# EAGLE board ubalancev0 (EAGLE 7.1.0)
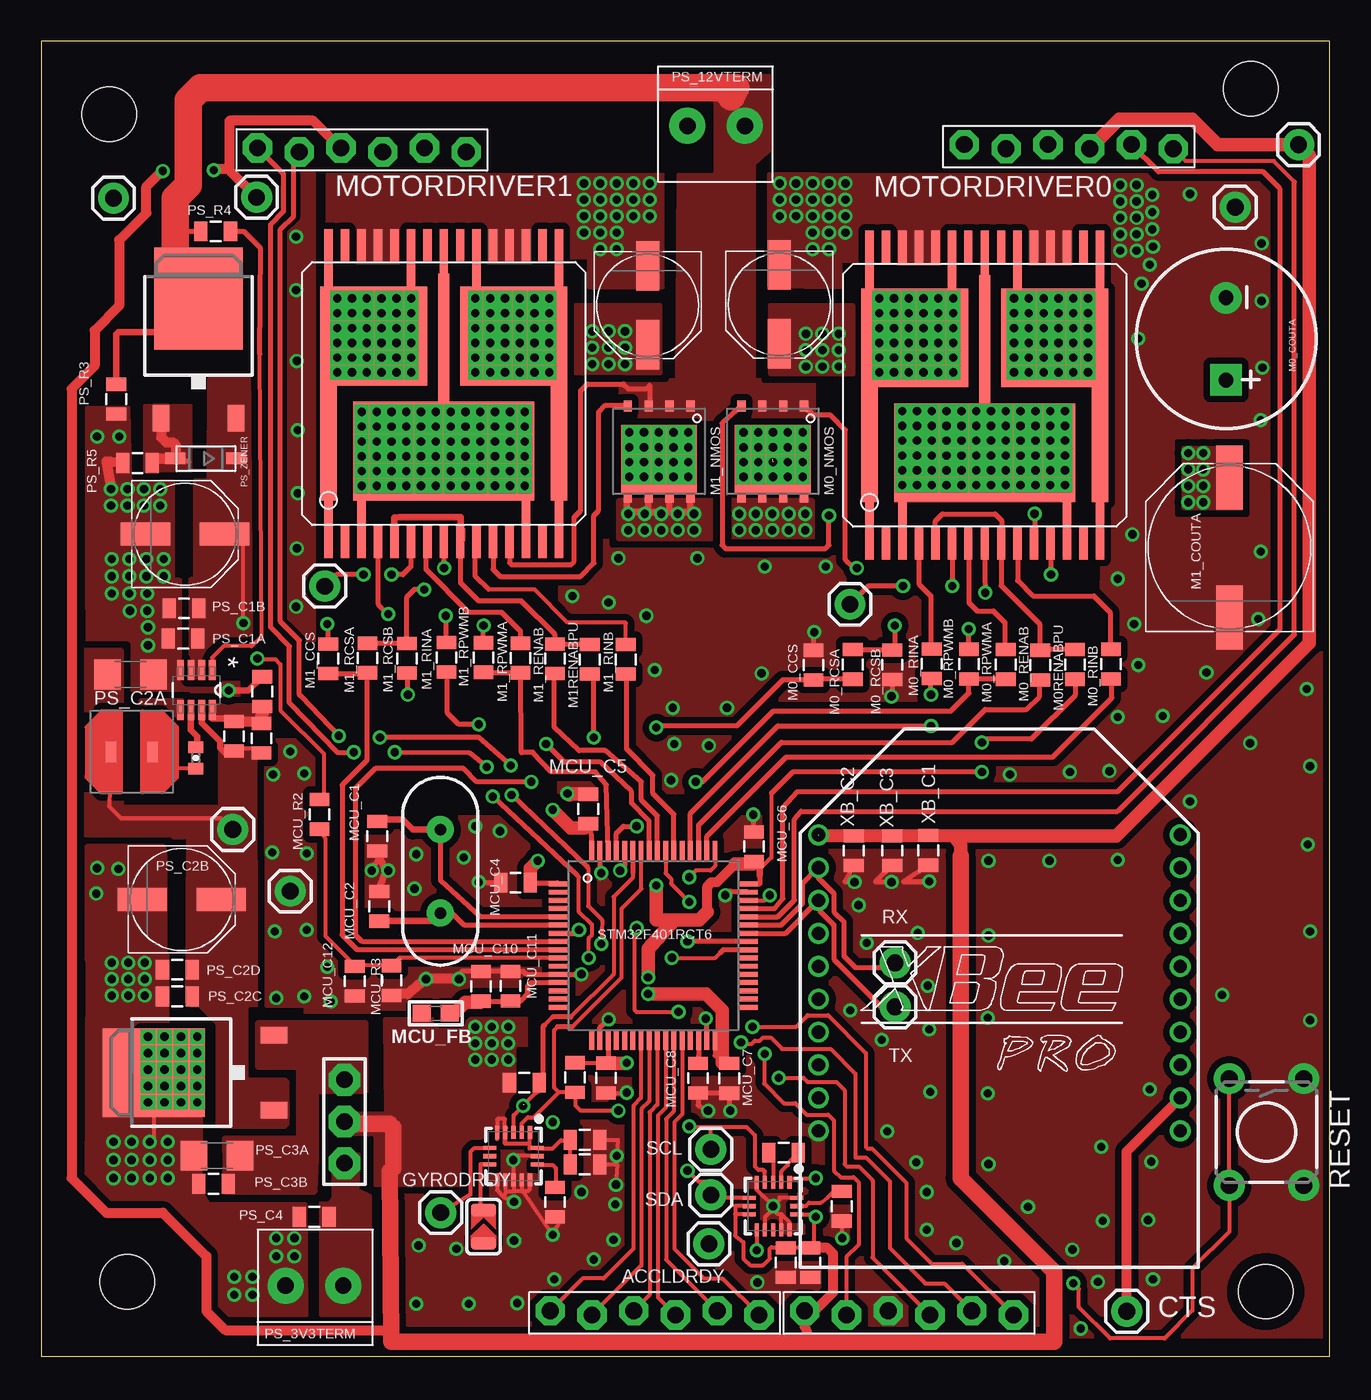
[diagram p2: board, top side]
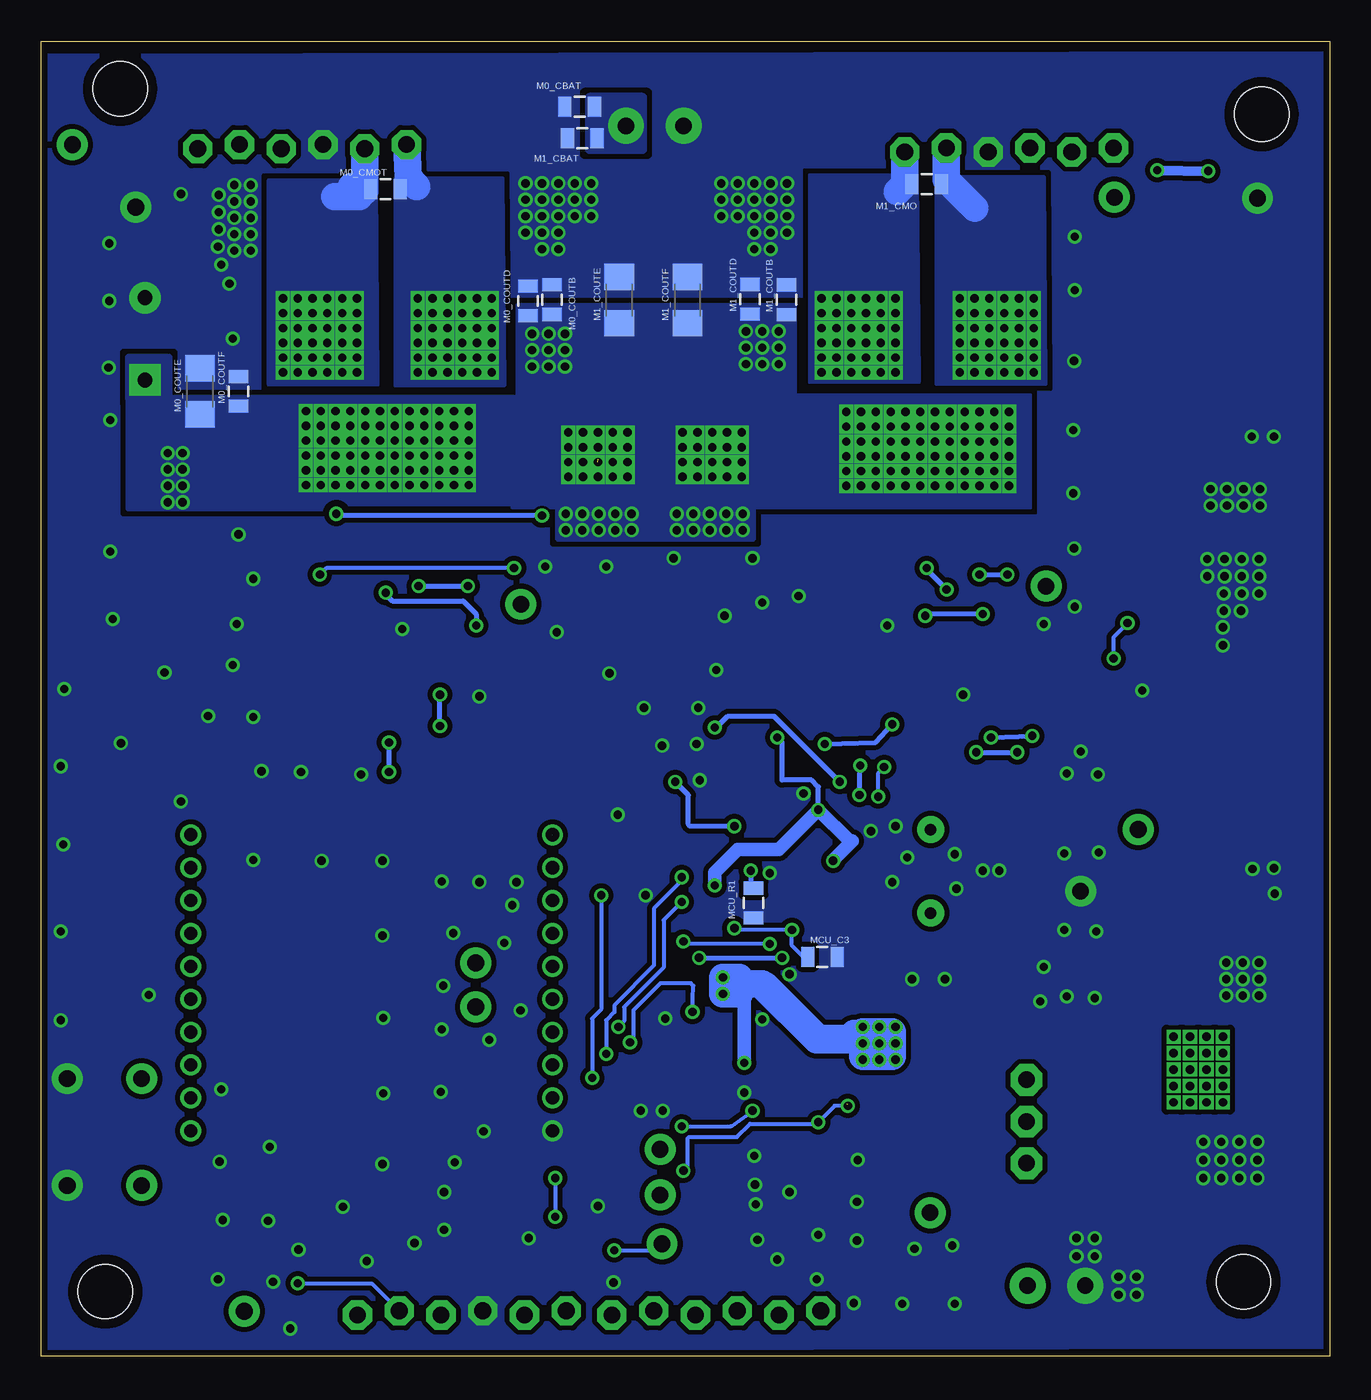
[diagram p3: board, bottom side, seen from below]

Size 78.35 x 80 mm. Coordinates in mm from the lower left corner, seen from the top.
Outline: 0,0 78.35,0 78.35,80 0,80 0,0
Copper layers (1*16): Top 0.0356mm / dielectric 1.5011mm / Bottom 0.0356mm
Design rules "LaenPCBOrder": minimum track width 6mil, minimum drill 13mil, track to track 6mil, track to pad 6mil, pad to pad 6mil, via to via 6mil, smd to smd 6mil, copper to edge 15mil, drill to drill 6mil, minimum pad ring 7mil, minimum via ring 7mil, stop-mask expansion 3mil, vias tented up to drill 0mil, thermal gap 10mil

## Footprints (pad centres in the part's own frame; a part is rotated, then mirrored left to right if it is on the bottom)
JUMPER3 = drill 1 pad 1.93 octagon: 1 -2.54,0; 2 0,0; 3 2.54,0
1X01 = drill 1.016 pad 1.88: 1 0,0
1X06-BIGLOCK = drill 1.016 pad 1.778 octagon: 1 -6.35,0.127; 2 -3.81,-0.127; 3 -1.27,0.127; 4 1.27,-0.127; 5 3.81,0.127; 6 6.35,-0.127
SOT65P280X100-8N = smd 1.219 x 0.406: 1 -1.219,0.965; 2 -1.219,0.33; 3 -1.219,-0.33; 4 -1.219,-0.965; 5 1.219,-0.965; 6 1.219,-0.33; 7 1.219,0.33; 8 1.219,0.965
0805 = smd 0.8 x 1.2: 1 -0.9,0; 2 0.9,0
CPOL-RADIAL-1000UF-25V-KIT = drill 0.9 pad 1.93 square: + 2.5,0 | drill 0.9 pad 1.93: - -2.5,0
PANASONIC_D = smd 3 x 1.4: + 2.4,0; - -2.4,0
1206 = smd 1.6 x 1.8: 1 -1.4,0; 2 1.4,0
8DFN-5*6MM = smd 0.5 x 0.65: D1 -1.905,2.8; D2 -0.635,2.8; D3 0.635,2.8; D4 1.905,2.8; G 1.905,-2.755; S1 -1.905,-2.755; S2 -0.635,-2.755; S3 0.635,-2.755 | smd 4.6 x 4.12: D5 0,0.46
PANASONIC_G = smd 3.9 x 1.6: + 4.25,0; - -4.25,0
0603 = smd 1.1 x 1: 1 -0.85,0; 2 0.85,0
MULTIPOWERSO-30 = smd 0.508 x 12: 1 -7,-4; 15 7,-4; 16 7,4; 30 -7,4 | smd 0.508 x 2: 2 -6,-9; 4 -4,-9; 5 -3,-9; 6 -2,-9; 7 -1,-9; 8 0,-9; 9 1,-9; 10 2,-9; 11 3,-9; 12 4,-9; 14 6,-9; 17 6,9; 18 5,9; 19 4,9; 20 3,9; 22 1,9; 24 -1,9; 26 -3,9; 27 -4,9; 28 -5,9; 29 -6,9 | smd 0.508 x 4: 3 -5,-8; 13 5,-8; 21 2,8; 23 0,8; 25 -2,8 | smd 6.5 x 6: OUTA -4.25,3.5; OUTB 4.25,3.5 | smd 1 x 7.5: OUTA@1 -7,-2.755; OUTB@1 7,-2.755 | smd 11 x 6: VCC 0,-3.5 | smd 0.65 x 8.3: VCC@1 0,3.145
1X2-3.5MM = drill 1 pad 2.184: 1 1.8,0; 2 -1.7,0
0402-CAP = smd 0.7 x 0.9: 1 -0.65,0; 2 0.65,0
VLCF5024 = smd 1.27 x 0.635: P1 0,1.27; P2 0,-1.27
TO252 = smd 1 x 1.6: 1 -2.28,-4.8; 2 2.28,-4.8 | smd 5.4 x 6.2: 3 0,2.5
SOD-123 = smd 1.2 x 0.7: A 1.85,0; C -1.85,0
TACTILE-PTH = drill 1.016 pad 1.88: 1 -3.251,2.261; 2 3.251,2.261; 3 -3.251,-2.261; 4 3.251,-2.261
SOLDERJUMPER_ARROW_NOPASTE = smd 0.762 x 1.524: 1 -1.016,0; 2 1.016,0
STAND-OFF = hole 3.302: 0,0
LQFP64 = smd 1.2 x 0.3: 1 -5.75,3.75; 2 -5.75,3.25; 3 -5.75,2.75; 4 -5.75,2.25; 5 -5.75,1.75; 6 -5.75,1.25; 7 -5.75,0.75; 8 -5.75,0.25; 9 -5.75,-0.25; 10 -5.75,-0.75; 11 -5.75,-1.25; 12 -5.75,-1.75; 13 -5.75,-2.25; 14 -5.75,-2.75; 15 -5.75,-3.25; 16 -5.75,-3.75; 33 5.75,-3.75; 34 5.75,-3.25; 35 5.75,-2.75; 36 5.75,-2.25; 37 5.75,-1.75; 38 5.75,-1.25; 39 5.75,-0.75; 40 5.75,-0.25; 41 5.75,0.25; 42 5.75,0.75; 43 5.75,1.25; 44 5.75,1.75; 45 5.75,2.25; 46 5.75,2.75; 47 5.75,3.25; 48 5.75,3.75 | smd 0.3 x 1.2: 17 -3.75,-5.75; 18 -3.25,-5.75; 19 -2.75,-5.75; 20 -2.25,-5.75; 21 -1.75,-5.75; 22 -1.25,-5.75; 23 -0.75,-5.75; 24 -0.25,-5.75; 25 0.25,-5.75; 26 0.75,-5.75; 27 1.25,-5.75; 28 1.75,-5.75; 29 2.25,-5.75; 30 2.75,-5.75; 31 3.25,-5.75; 32 3.75,-5.75; 49 3.75,5.75; 50 3.25,5.75; 51 2.75,5.75; 52 2.25,5.75; 53 1.75,5.75; 54 1.25,5.75; 55 0.75,5.75; 56 0.25,5.75; 57 -0.25,5.75; 58 -0.75,5.75; 59 -1.25,5.75; 60 -1.75,5.75; 61 -2.25,5.75; 62 -2.75,5.75; 63 -3.25,5.75; 64 -3.75,5.75
LGA16_3X3MM = smd 0.8 x 0.25: 1 -1.45,1; 2 -1.45,0.5; 3 -1.45,0; 4 -1.45,-0.5; 5 -1.45,-1; 9 1.45,-1; 10 1.45,-0.5; 11 1.45,0; 12 1.45,0.5; 13 1.45,1 | smd 0.25 x 0.8: 6 -0.5,-1.45; 7 0,-1.45; 8 0.5,-1.45; 14 0.5,1.45; 15 0,1.45; 16 -0.5,1.45
XBEE-PRO = drill 0.8 pad 1.27: 1 -11,9; 2 -11,7; 3 -11,5; 4 -11,3; 5 -11,1; 6 -11,-1; 7 -11,-3; 8 -11,-5; 9 -11,-7; 10 -11,-9; 11 11,-9; 12 11,-7; 13 11,-5; 14 11,-3; 15 11,-1; 16 11,1; 17 11,3; 18 11,5; 19 11,7; 20 11,9
HC49US = drill 0.7 pad 1.651: 1 -2.54,0; 2 2.54,0

## Placement (x,y rotation side)
3V3JUMPER  [JUMPER3]  18.44,14.29 270 top
3V3OUTM0  M01PTH  [1X01]  76.45,73.7 0 top
3V3OUTM1  M01PTH  [1X01]  13.1,70.5 0 top
5VOUT  M01PTH  [1X01]  11.65,32.05 0 top
ACCLDRDY  M01PTH  [1X01]  40.6,6.85 0 top
BREAKOUT  [1X06-BIGLOCK]  37.3,2.65 180 top
BUCK  LT3470ITS8PBF  [SOT65P280X100-8N]  9.44,40.53 270 top
CTS  M01PTH  [1X01]  66,2.75 0 top
GND_OUT  M01PTH  [1X01]  15.15,28.3 0 top
GND_OUT1  M01PTH  [1X01]  72.6,69.9 0 top
GND_OUT2  M01PTH  [1X01]  4.4,70.45 0 top
GYRODRDY  M01PTH  [1X01]  24.3,8.75 0 top
IMU_C1A  0.1uF  [0805]  33.06,11.68 0 top
IMU_C1B  10uF  [0805]  33.06,13.17 0 top
IMU_C1C  10nF  [0805]  31.24,9.39 270 top
IMU_C2A  0.1uF  [0805]  46.76,5.71 270 top
IMU_C2B  10uF  [0805]  45.27,5.71 270 top
IMU_C2C  0.22uF  [0805]  45.14,12.4 0 top
IMU_C2D  4.7uF  [0805]  48.67,9.14 90 top
M0_BUS  [1X06-BIGLOCK]  62.48,73.58 0 top
M0_CBAT  1uF  [0805]  45.61,76.01 180 bottom
M0_CCS  47nF  [0805]  46.96,42.05 90 top
M0_CMOT  0.1uF  [0805]  57.41,70.99 180 bottom
M0_COUTA  1000uf/25V  [CPOL-RADIAL-1000UF-25V-KIT]  72.04,61.89 270 top
M0_COUTB  0.1uF  [0805]  47.29,64.28 90 bottom
M0_COUTC  100uF  [PANASONIC_D]  44.88,63.98 270 top
M0_COUTD  1uF  [0805]  48.75,64.2 90 bottom
M0_COUTE  22uF  [1206]  68.7,58.7 90 bottom
M0_COUTF  22uF  [0805]  66.35,58.7 90 bottom
M0_CSDISABLE  M01PTH  [1X01]  49.18,45.75 0 top
M0_NMOS  AON6812  [8DFN-5*6MM]  44.48,55.05 180 top
M0_RCSA  10K  [0805]  49.35,42.09 90 top
M0_RCSB  1K  [0805]  51.75,42.07 90 top
M0_RENAB  1K  [0805]  60.75,42.05 90 top
M0_RINA  1K  [0805]  54.15,42.13 90 top
M0_RINB  1K  [0805]  65.05,42.11 90 top
M0_RPWMA  1K  [0805]  58.65,42.09 90 top
M0_RPWMB  10K  [0805]  56.41,42.11 270 top
M0RENABPU  10K  [0805]  62.86,42.09 90 top
M1_BUS  [1X06-BIGLOCK]  19.5,73.38 180 top
M1_CBAT  1uF  [0805]  45.45,74.09 180 bottom
M1_CCS  47nF  [0805]  17.46,42.44 90 top
M1_CMO  0.1uF  [0805]  24.51,71.3 180 bottom
M1_COUTA  470uF  [PANASONIC_G]  72.25,49.2 90 top
M1_COUTB  0.1uF  [0805]  33.04,64.27 90 bottom
M1_COUTC  100uF  [PANASONIC_D]  36.87,63.93 270 top
M1_COUTD  1uF  [0805]  35.25,64.3 90 bottom
M1_COUTE  22uF  [1206]  43.2,64.25 90 bottom
M1_COUTF  22uF  [1206]  39.05,64.25 90 bottom
M1_CSDISABLE  M01PTH  [1X01]  17.25,46.85 0 top
M1_NMOS  N-MOSFET-AON6812  [8DFN-5*6MM]  37.57,55.05 180 top
M1_RCSA  10K  [0805]  19.85,42.48 90 top
M1_RCSB  1K  [0805]  22.25,42.46 90 top
M1_RENAB  1K  [0805]  31.25,42.44 90 top
M1_RINA  1K  [0805]  24.65,42.52 90 top
M1_RINB  1K  [0805]  35.55,42.4 90 top
M1_RPWMA  1K  [0805]  29.15,42.48 90 top
M1_RPWMB  10K  [0805]  26.89,42.51 270 top
M1RENABPU  4.7K  [0805]  33.36,42.4 90 top
MCU_C1  20pF  [0805]  20.44,31.64 270 top
MCU_C2  20pF  [0805]  20.56,27.38 90 top
MCU_C3  0.1uF  [0805]  30.85,24.3 0 bottom
MCU_C4  1uF  [0805]  28.84,28.81 180 top
MCU_C5  0.1uF  [0805]  33.26,33.3 90 top
MCU_C6  0.1uF  [0805]  43.34,31.01 270 top
MCU_C7  0.1uF  [0805]  41.84,16.92 270 top
MCU_C8  4.7uF  [0805]  39.94,16.93 270 top
MCU_C9  0.1uF  [0805]  34.34,16.94 270 top
MCU_C10  0.1uF  [0805]  26.75,22.51 90 top
MCU_C11  12pF  [0805]  28.53,22.53 270 top
MCU_C12  0.1uF  [0805]  19.07,22.83 270 top
MCU_FB  [0603]  23.99,20.87 0 top
MCU_R1  10k  [0805]  35.04,27.58 270 bottom
MCU_R2  100k  [0805]  16.92,32.97 90 top
MCU_R3  13k  [0805]  21.31,22.87 90 top
MCU_RSCL  10k  [0805]  32.46,16.97 90 top
MCU_RSDA  10k  [0805]  29.38,16.65 180 top
MOTORDRIVER0  VNH5019  [MULTIPOWERSO-30]  57.37,58.46 0 top
MOTORDRIVER1  VNH5019  [MULTIPOWERSO-30]  24.48,58.56 0 top
PROGAMMER_BUS  [1X06-BIGLOCK]  52.77,2.65 0 top
PS_3V3TERM  1X2-3.5MM  [1X2-3.5MM]  16.57,4.31 0 top
PS_12VTERM  1X2-3.5MM  [1X2-3.5MM]  41.09,74.85 180 top
PS_C1A  0.1uF  [0805]  8.63,43.66 180 top
PS_C1B  1uF  [0805]  8.69,45.5 180 top
PS_C1C  100uF  [PANASONIC_D]  8.75,50.01 0 top
PS_C2A  22 uF  [1206]  5.43,41.48 0 top
PS_C2B  47uF  [PANASONIC_D]  8.55,27.79 0 top
PS_C2C  0.1uF  [0805]  8.28,21.9 180 top
PS_C2D  1uF  [0805]  8.28,23.52 180 top
PS_C3A  33 uF  [1206]  10.7,12.22 180 top
PS_C3B  0.1uF  [0805]  10.48,10.5 180 top
PS_C4  0.1uF  [0805]  16.6,8.5 180 top
PS_CBIASFB  22 pF  [0805]  13.4,37.6 90 top
PS_CBOOST  .22 uF  [0402-CAP]  9.4,36.41 270 top
PS_IND  33uH  [VLCF5024]  5.51,36.78 270 top
PS_LDO  7824DT  [TO252]  9.36,17.26 90 top
PS_PMOS  FDD4141TO252  [TO252]  9.57,61.85 0 top
PS_R1  604k  [0805]  11.73,37.72 270 top
PS_R2  200k  [0805]  13.44,40.44 270 top
PS_R3  1M  [0805]  4.57,58.22 90 top
PS_R4  100k  [0805]  10.61,68.42 180 top
PS_R5  100k  [0805]  5.86,54.33 0 top
PS_ZENER  [SOD-123]  10.01,54.61 180 top
RESET  [TACTILE-PTH]  74.5,13.65 270 top
RX  M01PTH  [1X01]  51.92,23.94 0 top
SCL  M01PTH  [1X01]  40.72,12.6 0 top
SDA  M01PTH  [1X01]  40.72,9.82 0 top
SJ1  [SOLDERJUMPER_ARROW_NOPASTE]  26.9,7.9 90 top
STANDOFF1  STAND-OFF  [STAND-OFF]  4.15,75.55 0 top
STANDOFF2  STAND-OFF  [STAND-OFF]  5.25,4.55 0 top
STANDOFF3  STAND-OFF  [STAND-OFF]  74.45,3.95 0 top
STANDOFF4  STAND-OFF  [STAND-OFF]  73.55,77.1 0 top
STM1  STM32F4  [LQFP64]  37.22,24.99 0 top
TX  M01PTH  [1X01]  51.92,21.26 0 top
U$1  L3GD20H  [LGA16_3X3MM]  28.72,12.19 270 top
U$2  LSM303D  [LGA16_3X3MM]  44.5,9.15 270 top
XB1  XBEE-PRO  [XBEE-PRO]  58.26,22.73 0 top
XB_C1  0.1uF  [0805]  53.94,30.78 270 top
XB_C2  0.1uF  [0805]  49.41,30.76 270 top
XB_C3  4.7uF  [0805]  51.74,30.76 270 top
Y1  8MHz(16pF)  [HC49US]  24.27,29.51 270 top

## Tracks (layer width: path | path; a pad name or v marks a point on that pad's centre or on a via)
3V3BAT
  pour Top (no thermals): 17,9.3 17,2.55 20,2.55 20,9.75 19.25,10.1 19.3,12.3 17.7,12.25 17.75,12.15 17.75,9.6 17.5,9.3
3V3OUT  (via drill 0.5)  (1 unrouted)
  Top 0.254: 29.7,12.85 29.7,12.65 30.17,12.65 U$1.16 30.21,12.65 31.1,12.65 31.6,13.15 32.24,13.15 IMU_C1B.1 | 29.7,12.85 29.7,13.64 U$1.1 | 27.72,13.23 U$1.5 27.72,14.4 27.75,14.4 27.75,14.45 28.2,14.45 28.2,13.9 28.25,13.9 28.2,13.85 28.2,12.95 | 28.2,12.95 29.6,12.95 29.7,12.85 | U$1.4 28.22,12.97 28.2,12.95 | IMU_C1A.1 IMU_C1B.1 | IMU_C1B.1 32.26,12.81 32.1,12.75 | MCU_C9.1 32.49,17.84 MCU_RSCL.2 | U$2.1 45.5,10.85 v47.1,10.85 | U$2.7 42.2,9.15 42.2,8.65 | 42.2,8.65 42.2,7.35 42.7,6.95 42.7,5.95 43.1,5.55 43.9,5.55 44.3,5.95 44.3,6.55 44.4,6.65 45.23,6.65 IMU_C2B.1 IMU_C2A.1 47,6.71 47,8.4 v47.1,8.5 46.95,8.65 U$2.14 | U$2.8 42.2,8.65 | 44.4,34.25 44.4,30.35 43.7,29.65 | 47.24,31.7 XB1.1
  Top 0.305: STM1.64 33.47,31.69 MCU_C5.1 | MCU_C4.1 31.4,28.81 STM1.1 | STM1.32 40.97,18.29 MCU_C7.1 | 43.3,28.75 43.29,28.74 STM1.48 43.3,28.75 | 43.3,29.95 43.3,30.07 MCU_C6.2 | M0RENABPU.1 62.86,40.21 60.2,37.55 57.4,37.55 v57.2,37.35 | v57.2,35.55 45.7,35.55 44.4,34.25 | 43.3,28.75 43.7,28.75 43.7,29.25 | 47.28,31.71 XB_C2.1 XB_C3.1 50.76,31.73 XB_C1.1 | STM1.19 34.47,17.97 MCU_C9.1 | v33.6,37.65 33.6,41.26 M1RENABPU.1
  Top 0.406: 43.3,29.95 43.4,29.95 43.7,29.65 43.7,29.25 | 63.6,73.6 M0_BUS.4
  Top 0.61: 46.75,0.9 46.42,1.83 PROGAMMER_BUS.1 47.03,2.78 48.15,3.9 48.15,6.25 47.8,6.6 IMU_C2A.1 | M1_BUS.4 18.19,73.51 16.55,75.15 11.45,75.15 11.45,72.2 | 21.3,0.9 21.15,1.6 11.2,1.6 10.05,2.75 10.05,6.1 7.4,8.75 3.95,8.75 1.85,10.85 1.85,58.85 3.25,60.25 3.25,62.4 4.75,63.9 4.75,67.9 6.4,69.55 6.4,71.15 7.3,72.05 v7.4,72.1 | 40.5,27.05 40.5,28.6 40.75,28.85 41.1,28.85 42.2,29.95 | 11.45,72.2 11.45,72.15 3V3OUTM1.1 | 11.45,72.2 10.55,72.2 v10.5,72.15
  Top 0.813: v36.9,22.05 40.4,22.05 41.4,21.05 41.4,17.86 MCU_C7.1 | 43.3,29.95 42.2,29.95 | 40.5,27.05 40,26.55 38.5,26.55 | 38.5,26.55 36.9,24.8 v36.9,23.05 | 38.5,26.55 37.4,26.55 v37.4,28.65 | MCU_C9.1 v35.59,17.84 v35.6,17.85 | 55.5,31.65 65.35,31.65 77.1,43.4 77.1,73.05 3V3OUTM0.1 71.55,73.7 70,75.25 65.55,75.25 M0_BUS.4 | 55.5,31.65 47.24,31.7 | 55.9,30.45 55.9,31.1 55.5,31.65 | MCU_C4.1 29.74,29.69 v30.2,30.15 | v31.1,33.25 32.2,32.15 33.01,32.15 MCU_C5.1
  Top 1.016: 55.9,30.45 55.9,10.85 61.6,5.15 61.6,0.9 46.75,0.9 21.3,0.9 21.2,11.25 21.4,11.45 21.4,13.95 21.2,14.15 18.58,14.15 3V3JUMPER.2
  Bottom 0.254: v47.1,10.85 v47.1,8.5
  Bottom 0.305: v57.2,37.35 v57.2,35.55 | v31.1,33.25 31.1,34.65 31.5,35.05 33.3,35.05 33.3,37.35 v33.6,37.65
  Bottom 0.61: v10.5,72.15 v7.4,72.1
  Bottom 0.813: v37.4,28.65 37.4,29.45 36,30.85 33.5,30.85 v31.1,33.25 29.2,31.35 29.05,31.35 30.2,30.2 v30.2,30.15 | v35.6,17.85 35.6,21.75 35.9,22.05
  Bottom 1.676: v36.9,22.05 v36.9,23.05 35.9,23.05 | v36.9,22.05 36.3,22.65 34.6,22.65 | 34.5,22.55 31.2,19.25 31,19.25 | 31,19.25 28.6,19.25 | 28.6,19.25 v28.4,19.05 | 34.6,22.65 34.5,22.55 | 34.5,22.55 34.4,22.55 | 31.1,19.35 31,19.25 | 28.6,19.25 26.8,19.25 26.7,19.35 | 34.6,22.65 34.5,22.65 34.4,22.55 | 34.4,22.55 34.3,22.55 31.1,19.35 | 31.1,19.35 29.2,19.35 28.9,19.65 26.7,19.65 26.6,19.75 26.6,18.25 28.4,18.25 28.4,19.75 26.7,19.75 | 35.9,22.05 v36.9,22.05
  other vias: 26.4,20.05 26.4,19.05 27.4,20.05 28.4,20.05 27.4,19.05 26.4,18.05 27.4,18.05 28.4,18.05
  pour Top (isolate 0.406, no thermals): 20.9,20.5 20.95,14.75 17.95,14.8 17.9,13.55 20.3,13.55 20.3,10.45 26.8,10.45 26.8,13.95 28.8,13.95 28.8,18.95 29.5,18.95 29.5,20.55
3V3OUTREG
  pour Top (isolate 0.406, no thermals): 19.7,20.25 13.2,20.25 13.2,17.65 15.7,17.65 15.7,13.25 11.2,13.25 11.25,10.05 16.6,10.05 16.7,12.1 16.7,16.15 19.7,16.15
5VOUT
  Top 0.254: PS_R1.2 11.82,36.82 12,37 13.3,37 PS_CBIASFB.1 | PS_IND.P2 4.14,33.46 4.85,32.75 10.95,32.75
  Top 0.305: BUCK.7 9.77,39.43
  Top 0.406: BUCK.7 9.77,38.53 10.9,37.4 10.9,37 11.2,36.7
  pour Top (isolate 0.406, rank 3, no thermals): 2.75,31.65 9,31.65 8.95,21.55 10.8,21.4 13.1,21.45 13,36.7 10.95,36.9 10.95,33.35 2.75,33.35
  pour Top (isolate 0.406, rank 3, no thermals): 9.1,24.75 9.1,24.35 9,24.25 9,21.55 9.1,21.45 9.6,21.45 10.8,20.25 10.8,14.25 11,14.05 14.8,14.05 14.9,14.15 14.9,16.65 14.8,16.75 12.4,16.75 12.4,24.35 12.1,24.65 9.2,24.65
  pour Top (isolate 0.406, no thermals): 4.85,42.9 4.85,33.45 2.65,33.55 2.65,42.9
12VBAT  (via drill 0.5)
  Top 0.305: 9.62,64.4 PS_PMOS.3 | MOTORDRIVER1.12 28.48,48.27 28.6,48.15 32.2,48.15 32.4,48.35 32.4,51.05 32.8,51.45 32.8,58.75 33.2,59.15 35.4,59.15 35.7,58.85 36.8,58.85 37,59.05 37,57.87 M1_NMOS.S3 | MOTORDRIVER0.12 61.37,47.98 v61.4,47.55 | v49.6,47.95 49.4,47.95 48.9,48.45 48.9,56.35 48,57.25 46.94,57.25 M0_NMOS.S1 | PS_R4.2 8.42,68.42 8.15,68.15
  Top 0.406: PS_R3.2 4.57,62.17 4.7,62.3 7.52,62.3 PS_PMOS.3
  Top 1.676: 41.95,76.61 42.24,77.15 9.7,77.15 8.95,76.4 8.95,71.25 8.15,70.45 8.15,68.15 8.15,65.77 PS_PMOS.3 9.7,64.22 9.7,63.8
  Bottom 0.254: v49.6,47.95 61,47.95 v61.4,47.55
  pour Top (isolate 0.406, rank 2, no thermals): 41,77.85 41,71.85 38.75,71.85 38.65,59.35 35.2,59.35 35.2,57.05 47,57.05 47,59.35 43.35,59.4 43.35,72.55 44.4,73.45 44.4,77.85
  pour Bottom (isolate 0.406, no thermals): 45,73.45 41.8,73.45 41.8,76.55 45,76.55
CAP
  Top 0.254: U$1.14 30.21,11.65 31.1,11.65 31.3,11.45 31.3,10.35 IMU_C1C.1
DRDYACCL  (via drill 0.5)
  Top 0.254: U$2.9 v43.5,6.45
  Bottom 0.254: v43.5,6.45 41,6.45 ACCLDRDY.1
DRDYGYRO
  Top 0.254: U$1.6 27.23,12.65 26.3,12.65 26.1,12.45 26.1,9.85 GYRODRDY.1
ENCODER0A
  Top 0.305: STM1.45 44.59,27.24 45.1,27.85 45.1,33.35 46,34.35 65.45,34.35 75.3,44.2 75.3,71.05 74.3,72.05 67.95,72.05 M0_BUS.5
ENCODER0B
  Top 0.254: 76.2,71.45 74.95,72.7 69.58,72.7 M0_BUS.6
  Top 0.305: STM1.44 44.79,26.74 45.8,27.75 45.8,32.65 46.2,33.15 65.45,33.15 76.2,43.9 76.2,71.45
ENCODER1A  (via drill 0.5)
  Top 0.254: 33.25,29.7 33.25,27.4 34.1,26.55 v34.05,25.1
  Top 0.305: STM1.41 39.35,25.24 v39.3,25.25 | 33.25,29.7 v28.6,34.15 | v28.55,35.95 26.6,37.65 v20.6,37.65 | 15.7,73.34 M1_BUS.5 15.35,72.91 15.35,69.35 14.55,68.55 14.55,44.7 15.7,43.55 15.7,40.25 15.8,40.15 v18.1,37.75
  Bottom 0.254: v34.05,25.1 39.15,25.1 v39.3,25.25
  Bottom 0.305: v28.6,34.15 v28.55,35.95 | v20.6,37.65 v18.1,37.75
ENCODER1B  (via drill 0.5)
  Top 0.254: 32.6,29.25 32.7,29.15 32.7,27.05 33.5,26.25 33.5,25.65 33.3,25.45 v33.3,24.25 | v38.35,24.25 41,24.25 41.3,24.55
  Top 0.305: 32.6,29.25 v27.45,34.05 | v27.1,35.85 26.05,36.7 v21.5,36.75 | 41.3,24.55 41.5,24.75 STM1.40 | v19,36.75 18,36.75 15.1,39.75 15.1,43.2 13.95,44.35 13.95,68.85 14.75,69.65 14.75,71.91 M1_BUS.6
  Bottom 0.254: v27.45,34.05 27.45,35.5 v27.1,35.85
  Bottom 0.305: v21.5,36.75 v19,36.75 | v38.35,24.25 v33.3,24.25
FB
  Top 0.406: BUCK.8 10.4,38.8 11.65,38.8 PS_R1.1 | 13.38,38.62 PS_CBIASFB.2 | PS_R2.2
  Top 0.61: PS_R1.1 13.38,38.62
  Top 0.813: PS_CBIASFB.2 PS_R2.2
  pour Top (isolate 0.406, no thermals): 10.7,38.9 13.9,38.9 13.9,39.7 13,39.7 13,39.6 10.7,39.6
GND  (via drill 0.5)
  Top 0.254: U$1.9 27.72,10.13 27.8,10.05 28.1,9.7 | 28.1,9.7 28.3,10.05 | 28.3,10.05 28.8,10.05 | 29.2,10.05 29.3,10.05 | 29.7,10.15 29.7,10.72 U$1.13 29.72,10.17 29.7,10.15 | U$1.12 29.22,10.07 29.2,10.05 | 28.8,10.05 28.72,10.13 U$1.11 28.72,12.07 v28.7,11.95 | U$1.10 28.22,10.13 28.3,10.05 | 29.7,10.15 29.6,10.05 29.3,10.05 | 29.3,10.05 v31.1,7.4 31.46,8.14 IMU_C1C.2 | 29.2,10.05 28.8,10.05 | IMU_C1B.2 35.07,13.17 v35,12.2 | IMU_C1A.2 35.02,11.68 v34.95,10.45 | U$1.15 28.84,12.19 v28.7,11.95 | 21.33,21.95 MCU_R3.1 | PS_LDO.3 6.86,13.31 v6.6,13.05 | U$2.16 44.9,9.65 44.9,9.55 v44.5,9.15 | v44.5,9.15 44.5,8.95 | 44.5,8.95 44,8.45 U$2.10 | U$2.5 43.5,10.15 v44.5,9.15 | U$2.13 45.5,8.15 45,8.65 | 45,8.65 44.8,8.65 44.5,8.95 | U$2.12 45,8.65 | 28.1,9.7 v28.75,9.4 | IMU_C2D.1 48.67,7.23 v48.7,7.2 | 28.7,11.69 v28.7,11.95
  Top 0.305: MCU_C4.2 26.66,28.81 | STM1.63 33.97,29.08 v34.05,29.4 | 26.77,23.43 MCU_C11.1 29.32,23.43 29.5,23.25 STM1.12 32.81,23.24 v32.85,23.25 | 26.77,23.43 MCU_C10.2 | MCU_C9.2 35.84,15.99 v35.6,16.05 | STM1.18 33.97,20.02 v34.5,20.5 | STM1.31 40.47,20.28 40.4,20.35 v40.4,20.55 | 41.8,15.05 41.84,15.09 MCU_C7.2 MCU_C8.2 39.95,15.3 40,15.25 v40.55,14.95 | STM1.47 41.41,28.24 v41.6,28.05 | M0_RCSB.1 51.75,40.1 51.7,40.05 | M0_CCS.2 46.96,44.01 v47,44.05 | M0_RPWMB.1 v56.41,44.24 v56.4,44.25 | M1_RPWMB.1 v26.89,44.44 v26.9,44.45 | M1_RCSB.1 22.25,40.3 v22.3,40.25 | M1_CCS.2 17.46,44.49 v17.4,44.55 | XB_C2.2 48.86,28.89 v49.45,28.85 | XB_C3.2 50.74,28.89 v51.7,28.85 | XB_C1.2 52.44,28.89 v54,28.9 | MCU_C6.1 43.34,32.91 v43.3,32.95 | 26.77,23.43 25.58,23.43 v25.4,22.95 | MCU_C1.2 20.44,30.09 20,29.65
  Top 0.406: MCU_C1.2 20.94,29.51 21,29.65 20.5,28.34 MCU_C2.2 | v11.4,40.5 12.6,40.5 PS_R2.1
  Top 0.61: PS_R5.1 3.97,54.43 v4.25,52.75 | v25.4,22.95 v23.4,22.95 22.3,22.05 21.39,22.05 MCU_R3.1
  Top 0.813: MCU_C5.2 32.05,34.2 32.1,34.15
  other vias: 7.25,51.75 5.35,47.45 4.3,48.5 5.25,51.75 6.4,48.5 5.25,52.75 6.5,43.25 7.25,52.75 3.4,55.95 5.35,46.4 7.45,47.45 4.3,46.4 4.25,51.75 6.25,51.75 5.5,11.95 6.6,11.95 7.7,11.95 7.7,13.05 5.5,13.05 6.3,21.95 5.3,21.95 4.3,21.95 5.3,23.95 4.3,23.95 4.3,22.95 5.3,22.95 6.3,22.95 6.3,23.95 4.7,29.65 3.35,28.15 3.4,29.7 7.45,48.5 4.3,47.45 4.75,55.95 6.4,47.45 5.35,48.5 6.25,52.75 4.4,13.05 4.4,11.95 4.4,10.85 5.5,10.85 6.6,10.85 7.7,10.85 33,71.35 34,71.35 35,71.35 36,71.35 33,70.35 34,70.35 35,70.35 36,70.35 33,69.35 34,69.35 35,69.35 36,69.35 33,68.35 34,68.35 35,68.35 45.9,71.35 46.9,71.35 47.9,71.35 48.9,71.35 45.9,70.35 46.9,70.35 47.9,70.35 48.9,70.35 45.9,69.35 46.9,69.35 47.9,69.35 48.9,69.35 46.9,68.35 47.9,68.35 48.9,68.35 37,71.35 37,70.35 37,69.35 44.9,71.35 44.9,70.35 44.9,69.35 46.9,67.35 47.9,67.35 34,67.35 35,67.35 66.6,67.25 66.6,71.25 66.6,70.25 66.6,69.25 66.6,68.25 65.6,67.25 65.6,71.25 65.6,70.25 65.6,69.25 65.6,68.25 21.1,29.55 20.1,29.55 26.6,28.85 32,34.25 51.7,40.15 41.7,39.45 34.5,45.85 47.7,48.05 41.9,14.95 32.3,46.25 36.8,45.05 40.6,37.15 43.8,41.55 49.2,21.05 51.1,19.25 50.2,25.15 49.7,27.45 37.3,41.75 38.4,39.45 38.5,37.25 35.1,48.55 39.9,48.55 44,48.05 27.9,31.95 26.4,32.25 25.7,30.35 22.8,30.55 22.7,28.45 53.9,22.55 53.3,25.75 54,19.9 57.6,30.15 57.6,25.6 61.3,30.15 38.3,35.05 34.9,9.25 34.8,7.1 33.6,5.9 31.2,4.7 28.95,3.25 22.8,3.2 26,3.2 51.45,13.7 53.85,7.7 53.2,11.8 53.85,10 55.65,6.9 58.55,5.8 65.45,30.2 57.55,20.6 57.55,16 57.6,11.7 60,9.1 62.7,6.5 63.2,1.7 43.55,4.5 6.5,44.35 6.45,46.4 6.45,45.35 5.4,45.35 14.05,30.65 15.15,36.8 16,35.45 14.1,35.4 15.4,7.2 14.3,7.2 14.3,6.1 15.4,6.1 12.85,4.85 11.75,4.85 11.75,3.75 12.85,3.75 16.15,30.6 16.15,25.95 17.4,23.7 14.3,21.8 14.2,25.85 17.6,21.6 16,21.9 22.95,6.75 25.25,6.55 28.75,7.05 67.55,70.65 67.55,69.6 67.55,68.55 67.6,67.5 74.2,67.7 74.2,64.2 67.4,66.4 74.25,60.15 74.15,56.95 74.15,48.95 70.85,41.6 74,44.85 65.45,47.3 66.45,44.55 65.45,38.9 66.7,42.05 67.4,16.25 64.45,12.75 64.55,8.25 67.5,11.85 67.3,8.3 64.25,4.55 67.6,4.7 69.85,33.75 73.5,37.3 71.8,22 54.05,16.1 32.85,10 15.5,68.1 15.5,64.85 15.55,60.55 15.6,56.35 15.6,52.5 15.55,49.15 15.5,45.6 66.35,50 69.85,70.7 66.9,65.25 66.7,61.9 76.95,40.6 68.2,38.95 64.95,35.6 58.9,35.4 62.55,35.55 77.15,35.9 77,31.15 77.15,25.85 77.15,20.45
  pour Top (isolate 0.406, rank 2, no thermals): 8.5,41 12,41 12,40.1 2.8,40.05 2.85,47.3 8.45,47.25
  pour Top (isolate 0.406, rank 2, no thermals): 2.8,45.5 2.8,57.7 5.3,57.7 5.4,53.4 5.5,53.25 8,53.25 8,47.2 8.5,45.5
  pour Top (isolate 0.406, rank 2, no thermals): 2.85,31 7.4,31 7.5,30.45 7.5,24.45 7.2,24.15 2.85,24.15
  pour Top (isolate 0.406, rank 2, no thermals): 2.9,24.4 2.85,9.3 9.55,9.35 9.6,11.65 9.7,19.45 9.6,19.75 7.8,19.75 7.6,19.95 7.6,24.35 4,24.35
  pour Top (isolate 0.254, no thermals): 28,12.75 28,11.45 29.5,11.45 29.5,12.75
  pour Top (isolate 0.406, no thermals): 13.65,37.5 13.7,23.65 13.7,21.35 18,21.35 18,24.05 16.7,25.35 16.6,37.45
  pour Top (no thermals): 18,21.35 21.8,21.35 21.8,22.25 18,22.25
  pour Top (isolate 0.406, rank 2, no thermals): 7.2,10.05 10.6,6.65 10.65,2.55 16.15,2.55 16.1,9.25 10.2,9.25 9.7,10.05
  pour Bottom (no thermals): 32.3,71.85 32.3,64.85 49.5,64.85 49.5,71.85
  pour Top (isolate 0.406, no thermals): 17.4,71.85 17.4,66.55 31.6,66.55 31.6,71.85
  pour Top (isolate 0.406, no thermals): 31.6,69.05 31.5,69.05 31.4,66.85 33.3,66.85 33.3,65.05 37.8,65.05 37.8,71.85 31.6,71.85
  pour Top (isolate 0.406, no thermals): 50.2,71.85 50.2,66.45 68.15,66.45 68.15,71.85
  pour Top (isolate 0.406, no thermals): 44.25,71.9 44.25,65.1 48.6,65.05 48.6,66.65 50.4,66.65 50.3,71.85
  pour Bottom (isolate 0.305, rank 2, no thermals): 0.35,0.6 78,0.45 77.95,79.1 0.3,79.25
  pour Top (isolate 0.406, no thermals): 21.5,27.95 19.5,27.95 19.5,31.15 21.5,31.15
  pour Top (isolate 0.406, rank 2, no thermals): 54.1,49.55 31.6,49.55 31.5,34.35 54,34.35
  pour Top (isolate 0.406, rank 5, no thermals): 20.4,10.35 20.7,10.35 20.7,1.25 78,1.25 77.9,32.75 16,32.75 16.1,19.35 20.4,19.35
  pour Top (isolate 0.254, no thermals): 45.3,9.95 43.7,9.95 43.7,8.35 45.3,8.35
  pour Top (isolate 0.406, no thermals): 64.9,71.85 75.8,71.7 75.75,58.9 64.65,59.05
  pour Top (isolate 0.406, rank 2, no thermals): 64.7,60.35 76.35,60.35 75.95,34.1 64.3,34.1
  pour Top (isolate 0.254, rank 5, no thermals): 14.4,72.1 16.55,71.95 16.55,43.55 14.4,43.7
  pour Top (isolate 0.406, rank 2, no thermals): 77.9,32.4 67.69,32.5 67.05,33.13 67.05,42.8 76.45,42.8 77,43.35 77.9,43.35
  pour Top (isolate 0.406, no thermals): 58.05,36.15 58.05,34.7 64.77,34.7 65.4,35.34 65.4,36 65.1,36.3 65.1,38.95 64.4,38.95 61.65,36.2
M0CS  (via drill 0.5)
  Top 0.305: M0_RCSA.1 47,41.19 M0_CCS.1 45.1,41.15 42.3,38.35 37.5,38.35 v37.4,38.25 | v29.8,34.95 26.5,34.95 25.7,35.75 20.3,35.75 19.1,34.55 19.1,25.65 19.5,25.25 STM1.8
  Bottom 0.305: v37.4,38.25 37.3,38.25 36.6,38.95 33.8,38.95 v29.8,34.95
M0ENAB
  Top 0.305: STM1.51 39.97,32.32 45,37.35 55.4,37.35 57.4,39.35 59.9,39.35 60.7,40.15 60.7,41.1 M0_RENAB.1
M0INA  (via drill 0.5)
  Top 0.305: v54.1,40.25 54.1,41.18 M0_RINA.1 | v54.1,38.35 44.8,38.35 39.47,33.02 STM1.52
  Bottom 0.305: v54.1,38.35 v54.1,40.25
M0INB
  Top 0.305: STM1.50 40.47,31.62 45.3,36.45 61.5,36.45 65.1,40.05 65.1,41.16 M0_RINB.1
M0OUTA  (via drill 0.5)
  Top 0.254: v52.75,61.65 52.81,61.65 MOTORDRIVER0.OUTA | v50.95,62.55 50.46,62.55 MOTORDRIVER0.30 | 50.37,58.92 50.37,59.27 v50.95,59.85 | v55.45,64.35 55.45,64.9 55.4,64.95
  Top 0.305: MOTORDRIVER0.30 | 55.4,64.95 55.4,66.43 MOTORDRIVER0.25 | MOTORDRIVER0.1 MOTORDRIVER0.OUTA@1 | MOTORDRIVER0.OUTA@1 50.37,56.62 50.4,56.65 50.4,55.73 MOTORDRIVER0.OUTA@1 | MOTORDRIVER0.OUTA@1 50.37,58.92
  Bottom 0.254: 55.5,71.15 56.35,71.15 M0_CMOT.1
  Bottom 1.676: M0_BUS.1 56.03,71.68 55.5,71.15
  other vias: 50.95,64.35 51.85,64.35 52.75,64.35 53.65,64.35 54.55,64.35 50.95,63.45 51.85,63.45 52.75,63.45 53.65,63.45 54.55,63.45 51.85,62.55 52.75,62.55 53.65,62.55 54.55,62.55 50.95,61.65 51.85,61.65 53.65,61.65 54.55,61.65 50.95,60.75 51.85,60.75 52.75,60.75 53.65,60.75 54.55,60.75 51.85,59.85 52.75,59.85 53.65,59.85 54.55,59.85 55.45,63.45 55.45,62.55 55.45,61.65 55.45,60.75 55.45,59.85
  pour Bottom (isolate 0.406, no thermals): 50.3,71.65 50.2,59.05 56.8,59.05 56.8,71.65
M0OUTB  (via drill 0.5)
  Top 0.254: v59.15,64.35 59.15,64.65 59.3,64.8 59.3,66.39 MOTORDRIVER0.21 | MOTORDRIVER0.OUTB 61.62,61.88 v61.85,61.65 | v63.65,62.55 64.28,62.55 MOTORDRIVER0.16 | v63.65,59.85 63.8,59.85 64.3,59.35
  Top 0.305: 59.4,66.43 MOTORDRIVER0.21 | MOTORDRIVER0.16 | 64.3,59.35 64.3,54.53 MOTORDRIVER0.15 MOTORDRIVER0.OUTB@1
  Bottom 0.254: 60.5,70.55 58.75,70.55 M0_CMOT.2
  Bottom 1.676: M0_BUS.2 58.67,70.88 59.5,71.15 59.5,71.05 59,70.55 60.5,70.55
  other vias: 60.05,64.35 60.95,64.35 61.85,64.35 62.75,64.35 59.15,63.45 60.05,63.45 60.95,63.45 61.85,63.45 62.75,63.45 59.15,62.55 60.05,62.55 60.95,62.55 61.85,62.55 62.75,62.55 59.15,61.65 60.05,61.65 60.95,61.65 62.75,61.65 59.15,60.75 59.15,59.85 63.65,64.35 60.05,60.75 60.95,60.75 61.85,60.75 62.75,60.75 60.05,59.85 60.95,59.85 61.85,59.85 62.75,59.85 63.65,63.45 63.65,61.65 63.65,60.75
  pour Bottom (isolate 0.406, no thermals): 58,71.55 57.9,59.1 64.5,59.1 64.5,71.55
M0PWM  (via drill 0.5)
  Top 0.305: STM1.61 34.97,31.82 35.4,32.25 v36.2,32.25 | M0_RPWMA.1 56.43,41.19 M0_RPWMB.2 56.4,40.35 55.3,39.25 44.5,39.25 40.2,34.95 v39.8,34.95
  Bottom 0.305: v36.2,32.25 38.9,32.25 39,32.35 39,34.15 v39.8,34.95
M1CS
  Top 0.305: M1_CCS.1 19.81,41.54 | 19.81,41.54 M1_RCSA.1 | 19.81,41.54 19.81,36.26 18.3,34.75 18.3,25.65 19.2,24.75 STM1.9
M1ENAB
  Top 0.305: STM1.56 37.47,32.88 36.5,33.85 36.5,34.95 34.3,36.85 32.7,36.85 31.2,38.25 31.2,41.49 M1_RENAB.1
M1INA  (via drill 0.5)
  Top 0.305: STM1.57 36.97,32.58 35.9,33.65 35.9,34.35 34,36.15 31.8,36.15 v30.7,37.25 | v26.6,38.45 25.4,38.45 24.7,39.15 24.7,41.57 M1_RINA.1
  Bottom 0.305: v30.7,37.25 27.6,37.35 v26.6,38.45
M1INB
  Top 0.305: STM1.54 38.47,32.98 37.2,34.25 37.2,35.35 35.6,36.95 35.6,41.45 M1_RINB.1
M1OUTA  (via drill 0.5)
  Top 0.254: v22.5,64.35 22.5,64.85 | MOTORDRIVER1.OUTA 20.21,62.06 v19.8,61.65 | v18,62.55 MOTORDRIVER1.30 | v18,59.85 18,59.65 17.5,59.15
  Top 0.305: 22.5,64.85 22.5,66.54 MOTORDRIVER1.25 | MOTORDRIVER1.30 | 17.5,59.15 17.5,55.83 MOTORDRIVER1.OUTA@1 MOTORDRIVER1.1
  Bottom 0.254: 21.6,69.85 22.16,69.85 M1_CMO.1
  Bottom 1.676: M1_BUS.2 23.31,71.56 21.6,69.85
  other vias: 18,63.45 18.9,63.45 19.8,63.45 20.7,63.45 21.6,63.45 18,61.65 18.9,61.65 20.7,61.65 21.6,61.65 18,60.75 18.9,62.55 19.8,62.55 20.7,62.55 21.6,62.55 18.9,60.75 19.8,60.75 20.7,60.75 21.6,60.75 18.9,59.85 19.8,59.85 20.7,59.85 21.6,59.85 22.5,59.85 22.5,60.75 22.5,61.65 22.5,62.55 22.5,63.45 18,64.35 18.9,64.35 19.8,64.35 20.7,64.35 21.6,64.35
  pour Bottom (no thermals): 17.4,71.75 17.3,59.15 23.9,59.15 23.9,71.75
M1OUTB  (via drill 0.5)
  Top 0.254: v29.1,61.65 29.1,61.69 MOTORDRIVER1.OUTB | 30.75,62.55 v30.9,62.55 MOTORDRIVER1.16 | v30.9,59.85 30.9,59.65 31.48,59.07 | v26.4,64.35 26.4,64.75
  Top 0.305: 26.4,64.75 26.4,66.48 MOTORDRIVER1.21
  Top 0.406: MOTORDRIVER1.15 MOTORDRIVER1.OUTB@1 31.48,59.07 | MOTORDRIVER1.16
  Bottom 0.254: 26.3,70.85 25.86,70.85 M1_CMO.2
  Bottom 1.676: M1_BUS.1 25.85,71.3 26.3,70.85
  other vias: 27.3,64.35 28.2,64.35 29.1,64.35 30,64.35 26.4,63.45 27.3,63.45 28.2,63.45 29.1,63.45 30,63.45 26.4,62.55 27.3,62.55 28.2,62.55 29.1,62.55 30,62.55 26.4,61.65 27.3,61.65 28.2,61.65 30,61.65 26.4,60.75 26.4,59.85 30.9,64.35 27.3,60.75 28.2,60.75 29.1,60.75 30,60.75 27.3,59.85 28.2,59.85 29.1,59.85 30,59.85 30.9,61.65 30.9,60.75 30.9,63.45
  pour Bottom (no thermals): 25.1,71.85 25,59.25 31.6,59.25 31.6,71.85
M1PWM
  Top 0.305: STM1.62 34.37,34.78 33.7,35.55 31,35.55 29.9,36.75 29.2,36.73 M1_RPWMA.1 26.92,41.58 M1_RPWMB.2
N$2
  Top 0.305: MOTORDRIVER1.11 27.48,47.87 27.9,47.45 32.8,47.45 33.6,48.25 33.6,51.15 33.9,51.45 33.9,57.45 34.3,57.85 35.62,57.85 M1_NMOS.G
N$4
  Top 0.406: BUCK.6 9.11,38.21 9.1,38.2 9.1,38.1 9.5,37.7 9.5,37.16 PS_CBOOST.1
N$6  (via drill 0.5)
  Top 0.305: M0_NMOS.G 41.45,56.8 41.4,56.75 41.4,49.35 41.6,49.15 47.7,49.15 47.9,49.35 v47.9,51.15 | v60.4,51.25 60.3,51.25 60.4,51.15 60.4,50.35 60.37,50.32 MOTORDRIVER0.11
  Bottom 0.305: v47.9,51.15 60.5,51.15 v60.4,51.25
N$8
  Top 0.254: U$2.3 44.54,10.64 44.54,12.1 IMU_C2C.1
N$9
  Top 0.254: STM1.23 36.47,15.72 36,15.25 36,6.55 34.2,4.75 32.92,4.75 BREAKOUT.6
N$10
  Top 0.305: 60.8,43 M0_RENAB.2 | M0_RENAB.2 60.7,43 60.7,44.55 58.37,46.88 MOTORDRIVER0.9 58.4,49.49 58.4,50.85 58,51.25 54.8,51.25 54.37,50.82 MOTORDRIVER0.5 | M0RENABPU.2 60.79,42.99 M0_RENAB.2
N$11
  Top 0.305: STM1.13 29.8,22.75 29.6,22.55 29.6,22.05 29.18,21.63 MCU_C11.2 28.51,21.61 MCU_C10.1
  Top 0.813: MCU_FB.2 25.12,20.87 25.8,21.55 26.69,21.55 MCU_C10.1
N$12
  Top 0.254: STM1.24 36.97,15.52 36.5,15.05 36.5,5.53 BREAKOUT.5
N$13
  Top 0.305: MOTORDRIVER0.4 53.37,46.98 54.1,46.25 54.1,43.08 M0_RINA.2
N$14
  Top 0.305: MOTORDRIVER0.10 59.37,47.18 60.3,46.25 64,46.25 65,45.25 65,43.06 M0_RINB.2
N$15
  Top 0.305: MOTORDRIVER0.7 56.4,49.03 56.4,45.85 56.9,45.35 57.9,45.35 58.6,44.65 58.6,43.04 M0_RPWMA.2 58.7,43.04
N$16  (via drill 0.5)
  Top 0.305: MOTORDRIVER0.6 55.4,49.46 v55.4,46.85 | v52.4,46.85 50.28,46.85 M0_CSDISABLE.1
  Bottom 0.305: v55.4,46.85 v52.4,46.85
N$17  (via drill 0.5)
  Top 0.305: MOTORDRIVER0.8 57.37,47.58 v57.4,46.45 | v51.9,44.45 51.9,43.12 M0_RCSB.2 51.73,42.99 M0_RCSA.2
  Bottom 0.305: 52.1,44.65 v51.9,44.45 51.9,45.15 52.7,45.95 57,45.95 57.4,46.35 v57.4,46.45
N$18
  Top 0.305: STM1.30 39.97,18.26 MCU_C8.1
N$19  (via drill 0.5)
  Top 0.305: STM1.60 35.47,29.82 v35.2,29.55
  Bottom 0.254: MCU_R1.1 35.2,28.69
  Bottom 0.305: v35.2,29.55 35.2,28.69
N$20
  Top 0.254: U$2.15 46.5,9.15 46.7,9.35 47.4,9.35 47.8,9.65 48.33,10.2 IMU_C2D.2
N$22
  Top 0.254: U$2.2 45,11.25 45.4,11.65 45.4,11.76 IMU_C2C.2
N$23
  Top 0.254: STM1.25 37.47,15.32 37,14.85 37,3.75 BREAKOUT.4
N$24
  Top 0.305: M1RENABPU.2 31.29,43.3 M1_RENAB.2 31.25,43.9 29.2,45.95 26.6,45.95 25.5,47.05 25.5,49.54 MOTORDRIVER1.9
  Top 0.406: MOTORDRIVER1.5 21.48,51.03 21.8,51.05 25.5,51.05 25.5,50.35 25.6,50.25 25.6,49.68 MOTORDRIVER1.9
N$25  (via drill 0.5)
  Top 0.305: MOTORDRIVER1.4 20.48,45.77 v21.1,45.15 | v24.6,45.05 24.6,43.47 M1_RINA.2
  Bottom 0.305: v21.1,45.15 24.5,45.15 v24.6,45.05
N$26
  Top 0.254: M1_RINB.2 35.55,44.6 35.5,44.65 32,44.65 30,46.65 27.2,46.65
  Top 0.305: 27.2,46.65 26.4,47.45 26.4,49.48 MOTORDRIVER1.10
N$27
  Top 0.305: M1_RPWMA.2 29.15,44.1 28,45.25 26,45.25 23.4,47.85 23.4,49.48 MOTORDRIVER1.7
N$28  (via drill 0.5)
  Top 0.305: MOTORDRIVER1.6 22.48,48.03 22,47.55 v21.3,47.55 | v19.6,47.55 17.95,47.55 M1_CSDISABLE.1
  Bottom 0.305: v21.3,47.55 v19.6,47.55
N$29  (via drill 0.5)
  Top 0.305: MOTORDRIVER1.8 24.48,47.97 v24.5,47.95 | v23.3,46.65 22.7,46.65 22.2,46.15 22.2,43.41 M1_RCSB.2 19.87,43.36 M1_RCSA.2
  Bottom 0.305: v24.5,47.95 24.5,47.85 v23.3,46.65
N$31
  Top 0.254: STM1.26 37.97,15.12 37.5,14.65 37.5,3.59 BREAKOUT.3
N$32
  Top 0.305: Y1.1 24.27,28.98 26.7,26.75 STM1.5
  Top 0.406: Y1.1 22.6,32.05 22,32.65 20.55,32.65 MCU_C1.1
N$34
  Top 0.305: Y1.2 24.98,26.97 25.7,26.25 STM1.6
  Top 0.406: MCU_C2.1 23.78,26.48 Y1.2
N$35
  Top 0.254: STM1.27 38.47,14.92 38,14.45 38,5.89 BREAKOUT.2
N$36
  Top 0.254: STM1.28 38.97,14.72 38.5,14.25 38.5,6.55 40.3,4.75 41.42,4.75 BREAKOUT.1
N$37
  Top 0.254: U$1.8 26.71,11.69 26.7,11.7 26.7,9.06 SJ1.2
N$38  (via drill 0.5)
  other vias: 8.5,17.45
N$39  (via drill 0.5)
  other vias: 7.5,17.45
N$40
  Top 0.61: CTS.1 66,12.47 XB1.12
N$145  (via drill 0.5)
  other vias: 9.5,19.45
N$146  (via drill 0.5)
  other vias: 8.5,19.45
N$147  (via drill 0.5)
  other vias: 7.5,19.45
N$148  (via drill 0.5)
  other vias: 6.5,19.45
N$149  (via drill 0.5)
  other vias: 6.5,18.45
N$150  (via drill 0.5)
  other vias: 6.5,17.45
N$151  (via drill 0.5)
  other vias: 6.5,16.45
N$152  (via drill 0.5)
  other vias: 6.5,15.45
N$153  (via drill 0.5)
  other vias: 7.5,15.45
N$154  (via drill 0.5)
  other vias: 8.5,15.45
N$155  (via drill 0.5)
  other vias: 9.5,15.45
N$156  (via drill 0.5)
  other vias: 9.5,16.45
N$157  (via drill 0.5)
  other vias: 9.5,17.45
N$158  (via drill 0.5)
  other vias: 9.5,18.45
N$159  (via drill 0.5)
  other vias: 8.5,18.45
N$160  (via drill 0.5)
  other vias: 7.5,16.45
N$163  (via drill 0.5)
  other vias: 8.5,16.45
N$164  (via drill 0.5)
  other vias: 7.5,18.45
NRST  (via drill 0.5)
  Top 0.254: v38.75,20.95 36.2,20.95 36.1,21.05 36.1,25.95 v36.2,26.05 | v42.55,19.1 42.65,19 43.2,19 43.4,19.2 43.7,19.2 43.9,19.4 44.35,19.4 45.05,18.7 48,18.7 49.5,17.2 49.5,12.1 50.15,12.1 51.6,10.65 51.6,6.6 53.75,4.45 54.91,4.45 PROGAMMER_BUS.5 | v62.75,4.45 63.1,4.1 63.1,3 65,1.1 68.3,1.1 70,2.8 70,5.35 72.24,7.59 RESET.4 RESET.3
  Top 0.305: STM1.7 32.69,25.74 v32.7,25.95
  Bottom 0.254: 32.8,25.95 36.1,25.95 v36.2,26.05 | v38.75,20.95 38.7,22.55 38.85,22.7 40.7,22.7 42.35,21.05 42.35,19.3 v42.55,19.1 | 32.55,25.8 v32.7,25.95 32.7,25 32,24.3 MCU_C3.1 | v62.75,4.45 58.25,4.45 PROGAMMER_BUS.5
  Bottom 0.305: v32.7,25.95 32.8,25.95
PMOSGATE
  Top 0.305: 8.97,54.42 PS_ZENER.A
  Top 0.61: PS_PMOS.1 7.29,55.91 7.6,55.6 8,55.6 8.2,55.4 8.2,54.65 PS_ZENER.A 6.8,54.6 6.76,54.56 PS_R5.2
  pour Top (no thermals): 6.3,53.9 9.1,53.9 9.1,57.8 6.3,57.8
SCL  (via drill 0.5)
  Top 0.254: 31.48,16.07 MCU_RSCL.1 32.5,16.03 32.5,15.25 32.8,14.95 v35.1,14.95 | 31.48,16.07 31.2,16.35 31.2,19.85 31.4,20.05 | U$1.2 29.22,14.17 29.6,14.55 29.96,14.55 31.48,16.07 | 32.3,20.05 35.3,23.05 35.3,27.25 36.5,28.45 36.5,30.71 STM1.58 | U$2.4 44,11.25 43.9,11.35 43.6,11.35 43.4,11.55 43.4,13.45 42.9,13.95 40.9,13.95 | SCL.1 40.72,13.93 40.9,13.95 | 40.9,13.95 39.7,13.95 v39.4,14
  Top 0.305: 32.3,20.05 31.4,20.05
  Bottom 0.254: v39.4,14 36.4,14 v35.1,14.95
SDA  (via drill 0.5)  (1 unrouted)
  Top 0.254: 31.1,20.65 30.6,20.15 | 35.97,29.42 35.97,29.12 34.8,27.95 34.8,23.25 32.2,20.65 | 29.3,15.32 v29.3,15.25 28.72,14.67 U$1.3 | U$2.6 40.89,9.65 SDA.1 40.72,10.63 39.97,10.63 v39.3,11.3 | 29.37,15.27 29.37,15.32 30.1,16.05 | 30.5,16.45 30.48,16.45 MCU_RSDA.1
  Top 0.305: STM1.59 35.97,29.42 | 32.2,20.65 31.1,20.65 | 30.6,20.15 30.5,20.05 30.5,16.45 30.1,16.05
  Bottom 0.254: v29.3,15.25 30.1,15.25 v31.1,14.25 31.2,14.15 35.25,14.15 36.05,13.35 38.95,13.35 39.05,13.25 39.05,11.55 v39.3,11.3
SHDN
  Top 0.254: 13.3,60.97 13.4,43.8 12.8,43.2 11.1,43.2 10.4,42.5 BUCK.1
  Top 0.305: 13.3,60.97 13.35,67.4 12.35,68.4 11.53,68.4 PS_R4.1
STMRX
  Top 0.305: STM1.43 44.99,26.24 46.3,27.55 46.3,28.77 XB1.2 47.26,29.09 48.2,28.15 48.2,27.05 48.8,26.45 48.8,24.35 49.5,23.65 51.63,23.65 RX.1
STMTX
  Top 0.254: 47.32,27.73 XB1.3
  Top 0.305: STM1.42 45.27,25.74 XB1.3 | 47.32,27.73 47.32,27.13 48.2,26.25 48.2,24.15 51.3,21.05 51.71,21.05 TX.1
SW
  Top 0.254: PS_CBOOST.2 6.63,35.76 PS_IND.P1
  pour Top (isolate 0.254, no thermals): 8.55,39.85 8.55,34.3 6.1,34.3 6.1,39.85
SWCLK/TCK  (via drill 0.5)
  Top 0.254: STM1.49 40.97,29.82 40.7,29.55 39.8,29.55 v39.4,29.15 | v44,18.4 43.95,18.35 43.95,16.6 45.15,15.4 45.85,15.4 46.55,14.7 47.85,14.7 48.2,14.35 48.2,11.3 48.6,10.9 49.4,10.9 49.7,10.6 49.7,6.8 48.95,6.05 48.95,2.53 PROGAMMER_BUS.2
  Bottom 0.254: v39.4,29.15 39.4,28.95 41.1,27.25 41.1,23.8 43.5,21.35 43.5,20.95 44,20.45 v44,18.4
SWDIO/TMS  (via drill 0.5)
  Top 0.254: STM1.46 43.99,27.74 v44.3,28.05 | v44.85,16.95 46.35,16.95 46.6,16.7 48.35,16.7 48.85,16.2 48.85,11.7 49,11.55 49.7,11.55 50.55,10.7 50.55,6.01 PROGAMMER_BUS.4
  Bottom 0.254: v44.3,28.05 44.3,21.1 44.85,20.55 v44.85,16.95
SWO  (via drill 0.5)
  Top 0.254: STM1.55 37.97,29.38 38.3,29.05 38.3,28.75 v39.4,27.65 | v43.25,20.05 45.9,20.05 46.6,20.75 47.85,20.75 50.15,18.45 50.15,12.75 50.25,12.65 50.5,12.65 52.6,10.55 52.6,7.2 54.15,5.65 55.99,5.65 PROGAMMER_BUS.6
  Bottom 0.254: v39.4,27.65 40.5,26.55 40.5,23.65 42.9,21.25 42.9,20.4 v43.25,20.05
VBAT
  Top 0.254: STM1.10 21.78,24.24 MCU_R3.2 19.11,23.77 MCU_C12.1 19.07,23.78 17.3,25.55 17.3,31.49 MCU_R2.1
VIN  (via drill 0.5)
  Top 0.254: MCU_R2.2 17.2,34.15 17.2,36.65 14.55,39.3 14.55,42.1 14.25,42.4 13.2,42.4 v13.15,42.45 | 12.4,50.3 12.1,50.6 | v12.3,44.6 12.3,50.25 | 12.4,50.3 12.45,50.3 | 12.45,50.3 12.45,50.4 12.4,50.4 12.4,50.3 | 12.4,50.3 12.4,50.25 12.1,50.25 | 11.15,50.25 12.1,50.25 | 12.1,50.25 12.1,50.45 12.5,50.45 12.5,50.3 12.45,50.3 | 12.45,50.3 12.45,50.25 12.3,50.25 | 12.4,50.3 12.3,50.3 12.3,50.25
  Bottom 0.254: v13.15,42.45 13.15,43.75 v12.3,44.6
  pour Top (isolate 0.406, no thermals): 9.8,41.3 9.1,41.3 9.1,47.3 12.9,47.3 12.9,44 12.5,43.6 10.6,43.6 10,43.1 9.9,43 9.9,41.4
  pour Top (isolate 0.406, no thermals): 12.9,46.8 12.9,59.4 12.7,59.6 10.4,59.6 10.2,59.4 10.15,53.25 9.35,53.25 9.35,46.8
VOUT  (via drill 0.5)  (1 unrouted)
  Top 0.254: v24.9,54.75 24.8,54.75 24.1,55.45 24.1,55.44 MOTORDRIVER1.VCC | v57.75,54.8 57.53,54.8 MOTORDRIVER0.VCC | v37.55,54.4 37.55,54.57 M1_NMOS.D5
  Top 0.406: M1_NMOS.D4 35.6,52.25 35.6,51.35 36.9,51.35 | 36.9,51.35 38.2,51.35 | 38.2,51.35 39.48,51.35 | 39.5,51.35 39.48,51.35 | 39.48,51.35 M1_NMOS.D1 | M1_NMOS.D2 38.2,51.35 | M1_NMOS.D3 36.9,52.25 36.9,51.35 | M0_NMOS.D4 42.6,52.25 | M0_NMOS.D2 | M0_NMOS.D1 46.4,52.25
  other vias: 42.7,56.2 43.6,56.2 44.5,56.2 45.4,56.2 46.3,56.2 42.45,51.25 42.45,50.25 43.45,51.25 43.45,50.25 37.7,51.25 37.7,50.25 38.7,51.25 38.7,50.25 39.7,51.25 39.7,50.25 35.7,51.25 35.7,50.25 36.7,51.25 36.7,50.25 44.45,51.25 44.45,50.25 45.45,51.25 45.45,50.25 46.45,51.25 46.45,50.25 35.5,61.35 35.5,62.35 35.5,60.35 34.5,61.35 34.5,62.35 34.5,60.35 33.5,61.35 33.5,62.35 33.5,60.35 48.5,61.2 48.5,62.2 48.5,60.2 47.5,61.2 47.5,62.2 47.5,60.2 46.5,61.2 46.5,62.2 46.5,60.2 42.7,55.3 43.6,55.3 44.5,55.3 45.4,55.3 46.3,55.3 42.7,54.4 43.6,54.4 44.5,54.4 45.4,54.4 46.3,54.4 42.7,53.5 43.6,53.5 44.5,53.5 45.4,53.5 46.3,53.5 35.75,56.2 36.65,56.2 37.55,56.2 38.45,56.2 39.35,56.2 35.75,55.3 36.65,55.3 37.55,55.3 38.45,55.3 39.35,55.3 35.75,54.4 36.65,54.4 38.45,54.4 39.35,54.4 35.75,53.5 36.65,53.5 37.55,53.5 38.45,53.5 39.35,53.5 52.35,57.5 53.25,57.5 54.15,57.5 55.05,57.5 55.95,57.5 52.35,56.6 53.25,56.6 54.15,56.6 55.05,56.6 55.95,56.6 52.35,55.7 53.25,55.7 54.15,55.7 55.05,55.7 55.95,55.7 52.35,54.8 53.25,54.8 54.15,54.8 55.05,54.8 55.95,54.8 52.35,53.9 52.35,53 56.85,57.5 53.25,53.9 54.15,53.9 55.05,53.9 55.95,53.9 53.25,53 54.15,53 55.05,53 55.95,53 56.85,53 57.75,53 58.65,53 59.55,53 60.45,53 56.85,53.9 57.75,53.9 58.65,53.9 59.55,53.9 60.45,53.9 56.85,54.8 58.65,54.8 59.55,54.8 60.45,54.8 56.85,55.7 57.75,55.7 58.65,55.7 59.55,55.7 60.45,55.7 56.85,56.6 57.75,56.6 58.65,56.6 59.55,56.6 60.45,56.6 57.75,57.5 58.65,57.5 59.55,57.5 60.45,57.5 61.35,57.5 61.35,55.7 62.25,55.7 61.35,54.8 62.25,54.8 61.35,53.9 62.25,53.9 61.35,53 62.25,53 61.35,56.6 62.25,56.6 62.25,57.5 24.9,57.45 25.8,57.45 26.7,57.45 27.6,57.45 28.5,57.45 24,56.55 24.9,56.55 25.8,56.55 26.7,56.55 27.6,56.55 24,55.65 24.9,55.65 25.8,55.65 26.7,55.65 27.6,55.65 24,54.75 25.8,54.75 26.7,54.75 27.6,54.75 24,53.85 24.9,53.85 25.8,53.85 26.7,53.85 27.6,53.85 24,52.95 24.9,52.95 25.8,52.95 26.7,52.95 27.6,52.95 20.4,52.95 21.3,52.95 22.2,52.95 23.1,52.95 20.4,53.85 21.3,53.85 22.2,53.85 23.1,53.85 19.5,54.75 20.4,54.75 21.3,54.75 22.2,54.75 23.1,54.75 19.5,53.85 19.5,52.95 24,57.45 19.5,55.65 20.4,55.65 21.3,55.65 22.2,55.65 23.1,55.65 19.5,56.55 20.4,56.55 21.3,56.55 22.2,56.55 23.1,56.55 19.5,57.45 20.4,57.45 21.3,57.45 22.2,57.45 23.1,57.45 28.5,55.65 29.4,55.65 28.5,54.75 29.4,54.75 28.5,53.85 29.4,53.85 28.5,52.95 29.4,52.95 28.5,56.55 29.4,56.55 29.4,57.45 70.65,54.95 69.75,54.95 69.75,53.95 70.65,53.95 69.75,52.95 70.65,52.95 70.65,51.95 69.75,51.95
  pour Bottom: 18.2,58.45 33.8,58.45 33.8,51.65 18.2,51.65
  pour Bottom (no thermals): 32.5,63.95 49.4,63.95 49.4,55.25 32.5,55.25
  pour Bottom: 32.1,56.85 49.6,56.85 49.7,51.65 32.2,51.65
  pour Bottom (isolate 0.406, no thermals): 49.1,58.35 73.1,58.35 73.1,51.55 49.1,51.55
  pour Top (isolate 0.406, no thermals): 35.1,52.05 35.1,49.75 46.9,49.75 46.9,52.05
  pour Bottom: 35.1,52.15 35.1,49.75 46.9,49.75 46.9,52.15
  pour Top (isolate 0.406, no thermals): 37.6,63.95 37.6,59.8 32.55,59.8 32.55,63.95
  pour Top (no thermals): 49.35,63.9 49.35,59.75 44.35,59.75 44.35,63.95
  pour Bottom (isolate 0.406, no thermals): 70.5,58.25 70.5,60.8 73.1,60.8 73.1,58.25
  pour Top (isolate 0.406, no thermals): 72.95,55.25 69.45,55.25 69.45,51.6 72.95,51.6 73,51.65 72.95,51.7